# Altium schematic sheet ESP32.SchDoc
size 317 x 241 mm; SheetNumber: 5; SheetTotal: 5
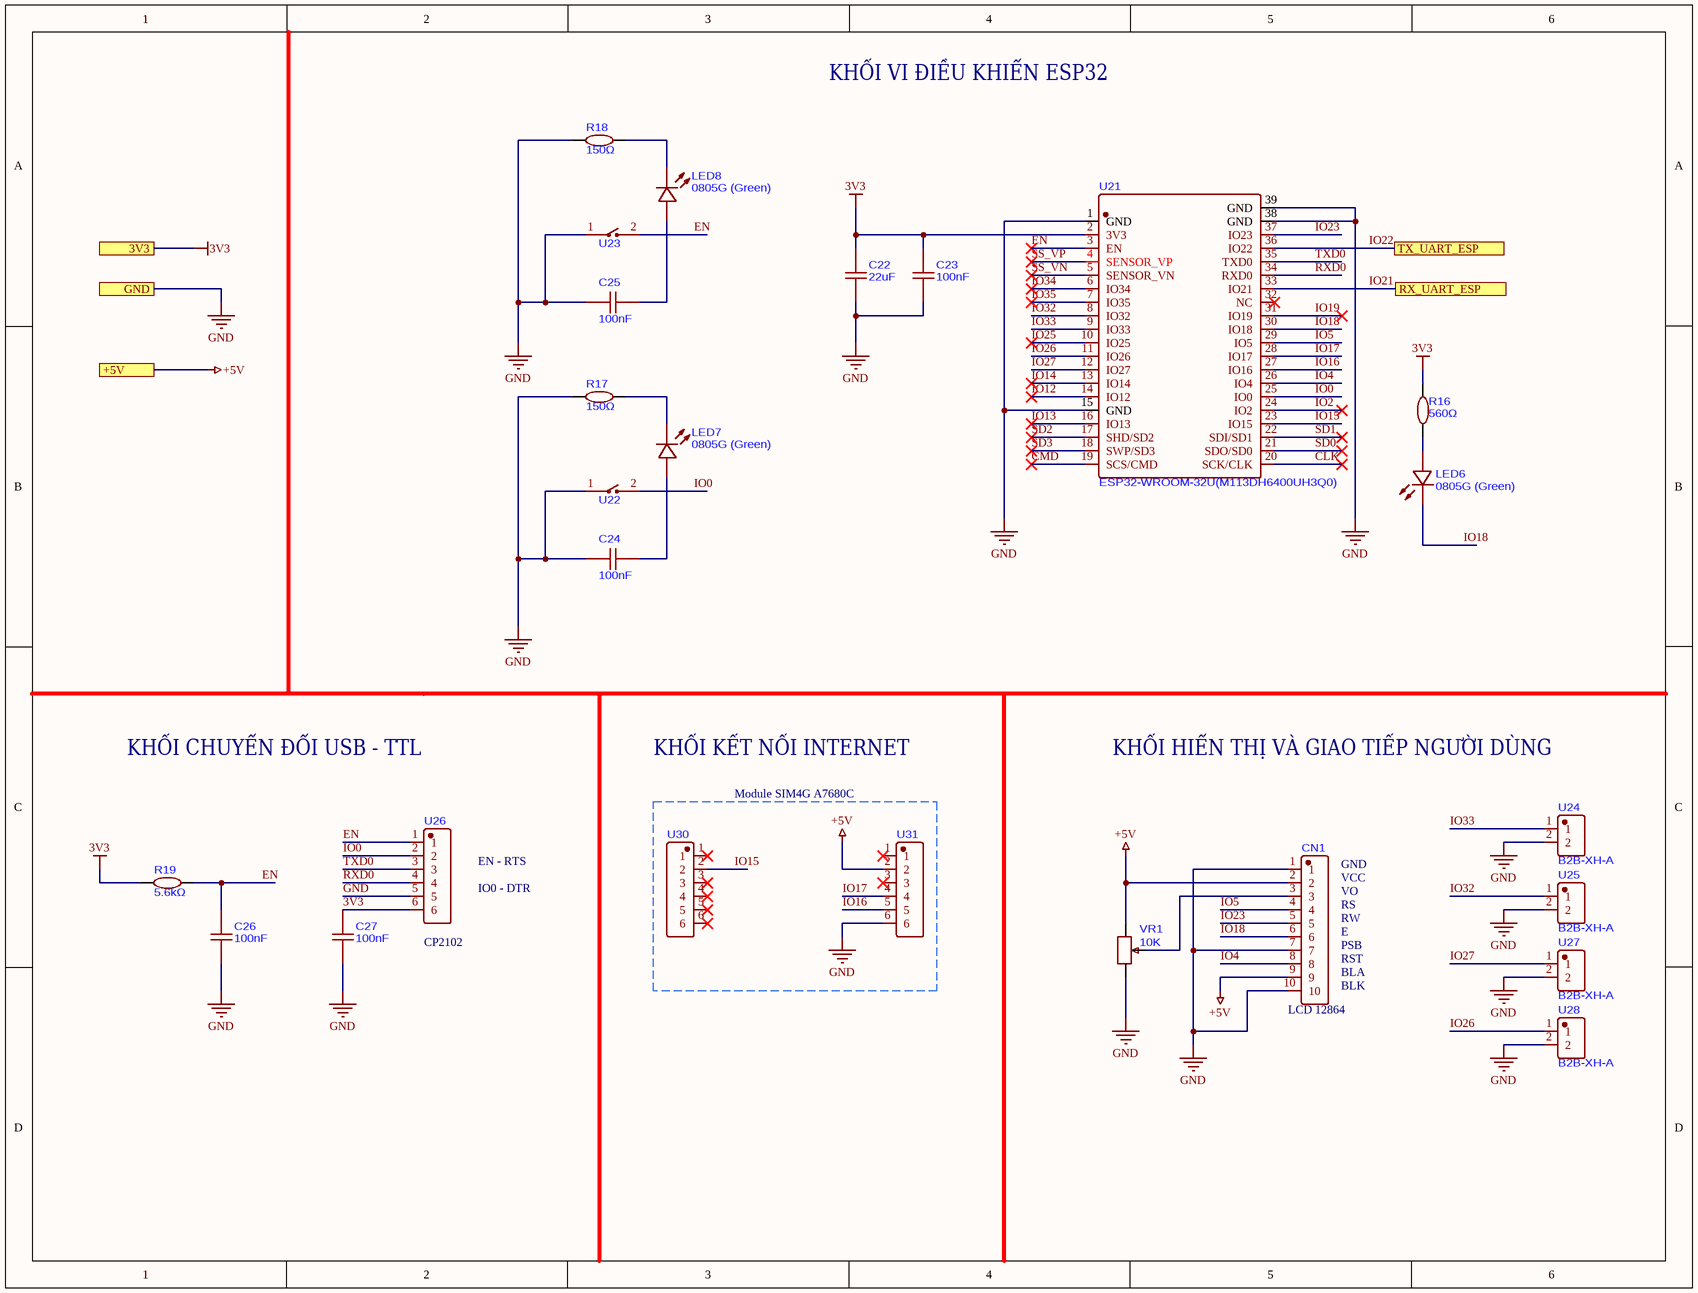
[diagram p0: ESP32.SchDoc]

## Parts
C22  22uF  [C0805]
C23  100nF  [C0805]
C24  100nF  [C0805]
C25  100nF  [C0805]
C26  100nF  [C0805]
C27  100nF  [C0805]
CN1  ZX-XH2.54-10PZZ-GW  [CONN-TH_10P-P2.50_ZX-XH2.54-10PZZ-GW]  (value not drawn)
LED6  0805G (Green)  [LED0805-R-RD]
LED7  0805G (Green)  [LED0805-R-RD]
LED8  0805G (Green)  [LED0805-R-RD]
R16  560Ω  [R0805]
R17  150Ω  [R0805]
R18  150Ω  [R0805]
R19  5.6kΩ  [R0805]
U21  ESP32-WROOM-32U(M113DH6400UH3Q0)  [WIFI-SMD_ESP32-WROOM-32UE-A]
U22  轻触按键 3X6X2.5MM  [SW-SMD_L6.1-W3.7-LS8.0]  (value not drawn)
U23  轻触按键 3X6X2.5MM  [SW-SMD_L6.1-W3.7-LS8.0]  (value not drawn)
U24  B2B-XH-A  [CONN-TH_XH-2A]
U25  B2B-XH-A  [CONN-TH_XH-2A]
U26  HB-PH3-25416PB2GOP  [HDR-TH_6P-P2.54-V-M]  (value not drawn)
U27  B2B-XH-A  [CONN-TH_XH-2A]
U28  B2B-XH-A  [CONN-TH_XH-2A]
U30  HB-PH3-25416PB2GOP  [HDR-TH_6P-P2.54-V-M]  (value not drawn)
U31  HB-PH3-25416PB2GOP  [HDR-TH_6P-P2.54-V-M]  (value not drawn)
VR1  10K  [RES-ADJ-TH_3P-L9.5-W9.5-P2.50-3386P-1-103_C48601064]

## Blocks framed on the sheet
Module SIM4G A7680C: U30 U31

## Ports
3V3 (see Merg_project[2B], 12VDC_3V3DC_LM2596[5B], ATmega32P[1A]), +5V (see Merg_project[2C], 12VDC_5VDC_XL4015[4B], ATmega32P[1A]), GND (see Merg_project[2C], 12VDC_3V3DC_LM2596[5C], 12VDC_5VDC_XL4015[4C], ATmega32P[1A]), RX_UART_ESP (see Merg_project[2C]), TX_UART_ESP (see Merg_project[2C])

## Nets
3V3: C22.2 C23.2 C27.2 R16.2 R19.1 U21.2(3V3) U26.6 ; port 3V3
+5V: CN1.2 CN1.9 U31.2 VR1.1 ; port +5V
GND: C22.1 C23.1 C24.2 C25.2 C26.1 C27.1 CN1.1 CN1.7 CN1.10 R17.2 R18.2 U21.1(GND) U21.15(GND) U21.38(GND) U21.39(GND) U22.1 U23.1 U24.2 U25.2 U26.5 U27.2 U28.2 U31.6 VR1.3 ; port GND
CLK: U21.20(SCK/CLK)
CMD: U21.19(SCS/CMD)
EN: C26.2 R19.2 U21.3(EN) U23.2 U26.1
IO0: U21.25(IO0) U22.2 U26.2
IO2: U21.24(IO2)
IO4: CN1.8 U21.26(IO4)
IO5: CN1.4 U21.29(IO5)
IO12: U21.14(IO12)
IO13: U21.16(IO13)
IO14: U21.13(IO14)
IO15: U21.23(IO15) U30.2
IO16: U21.27(IO16) U31.5
IO17: U21.28(IO17) U31.4
IO18: CN1.6 LED6.2(K) U21.30(IO18)
IO19: U21.31(IO19)
IO21: U21.33(IO21) ; port RX_UART_ESP
IO22: U21.36(IO22) ; port TX_UART_ESP
IO23: CN1.5 U21.37(IO23)
IO25: U21.10(IO25)
IO26: U21.11(IO26) U28.1
IO27: U21.12(IO27) U27.1
IO32: U21.8(IO32) U25.1
IO33: U21.9(IO33) U24.1
IO34: U21.6(IO34)
IO35: U21.7(IO35)
RXD0: U21.34(RXD0) U26.4
SD0: U21.21(SDO/SD0)
SD1: U21.22(SDI/SD1)
SD2: U21.17(SHD/SD2)
SD3: U21.18(SWP/SD3)
SS_VN: U21.5(SENSOR_VN)
SS_VP: U21.4(SENSOR_VP)
TXD0: U21.35(TXD0) U26.3
NetC24_1: C24.1 LED7.1(A)
NetC25_1: C25.1 LED8.1(A)
NetCN1_3: CN1.3 VR1.2
NetLED6_1: LED6.1(A) R16.1
NetLED7_2: LED7.2(K) R17.1
NetLED8_2: LED8.2(K) R18.1

Not connected (* = marked no-connect by the designer): U21 32(NC)*; U30 1* 3* 4* 5* 6*; U31 1* 3*

## Notes on the sheet
- KHỐI VI ĐIỀU KHIỂN ESP32
- KHỐI CHUYỂN ĐỔI USB - TTL
- KHỐI KẾT NỐI INTERNET
- KHỐI HIỂN THỊ VÀ GIAO TIẾP NGƯỜI DÙNG
- EN - RTS
- IO0 - DTR
- (near CN1) GND
- (near CN1) VCC
- (near CN1) VO
- (near CN1) RS
- (near U26) CP2102
- (near CN1) RW
- (near CN1) E
- (near CN1) PSB
- (near CN1) RST
- (near CN1) BLA
- (near CN1) LCD 12864
- (near CN1) BLK

## Library data of the parts
C22-C27 = CC0805KRX7R9BB104
R16 = 0805W8F5101T5E
R17 R18 = RC0805FR-07330RL
R19 = RC0805FR-075K6L
VR1 = 3386P-1-103_C48601064